# EAGLE design Solar Charger Board (EAGLE 7.2.0)
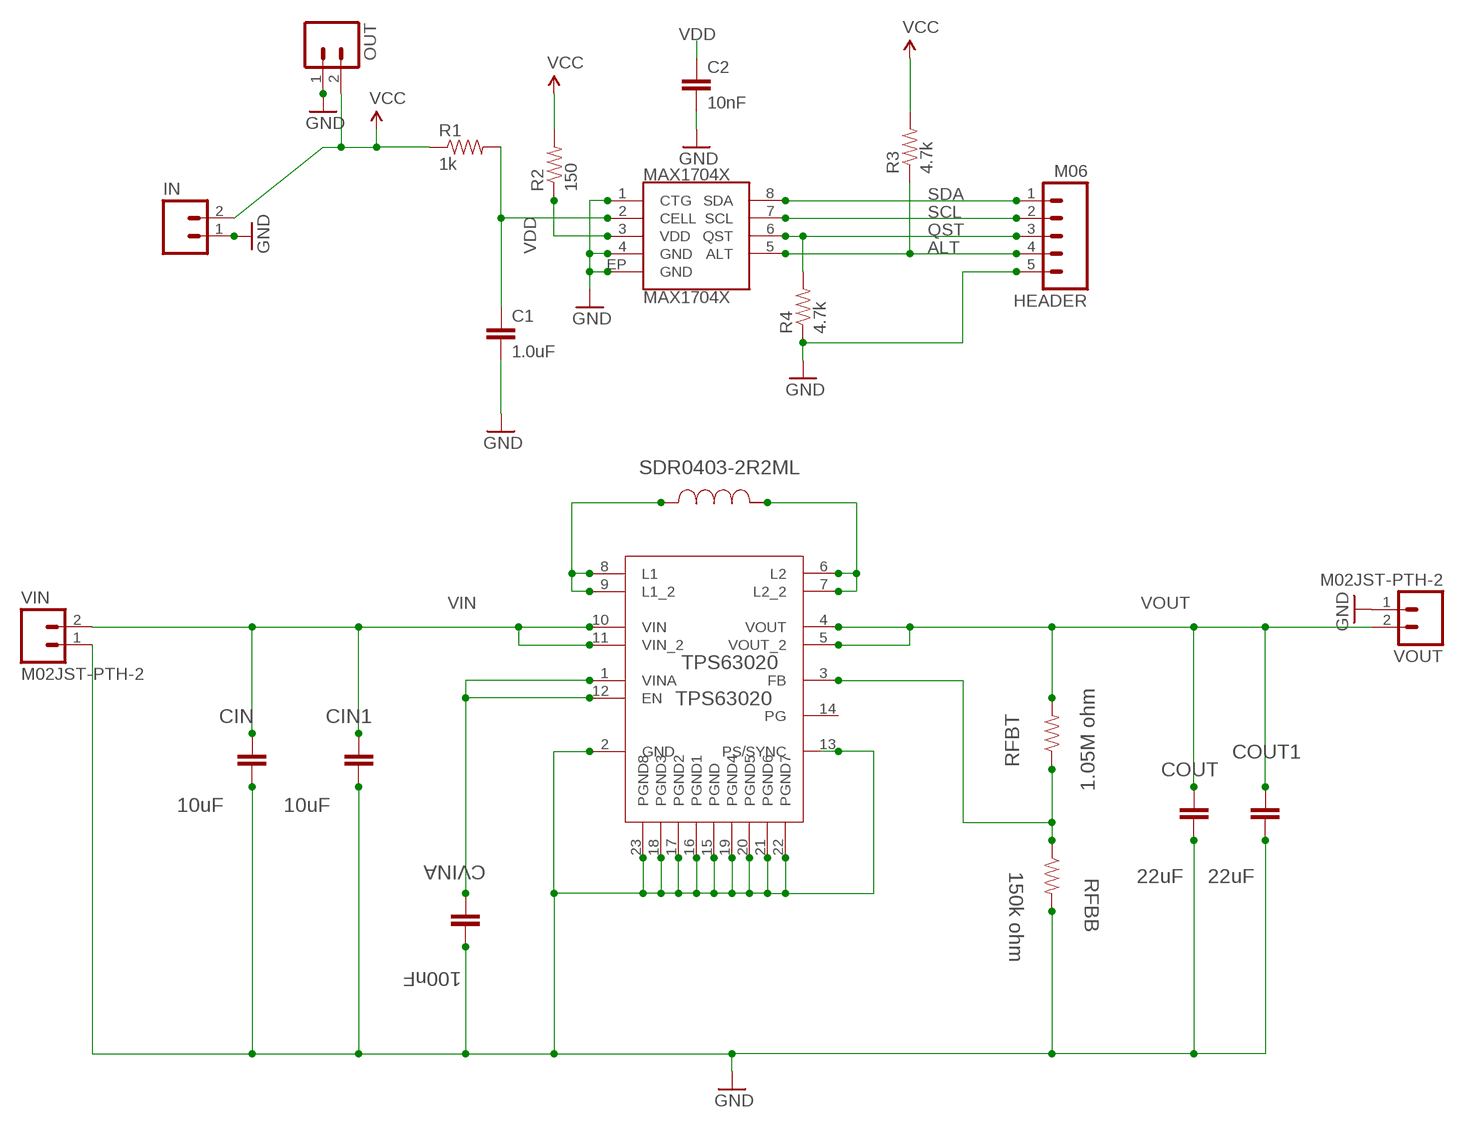
[diagram p0: schematic, sheet 1]

## Parts
C1  1.0uF  1.0UF-25V-+80/-20(0805)  [0805]
C2  10nF  2.2UF-25V-+80/-20(0805)  [0805]
CIN  10uF  CAP0805  [0805]
CIN1  10uF  CAP0805  [0805]
COUT  22uF  CAP0805  [0805]
COUT1  22uF  CAP0805  [0805]
CVINA  100nF  CAP0805  [0805]
HEADER  M06  M05PTH  [1X05]
IN  input  M02JST-PTH-2  [JST-2-PTH]
L1  SDR0403-2R2ML  [SDR0403]
MAX1704X  MAX1704X  [TDFN-8]
OUT  M02JST-PTH-2  [JST-2-PTH]
R1  1k  RESISTOR0805-RES  [0805]
R2  150  RESISTOR0805-RES  [0805]
R3  4.7k  RESISTOR0805-RES  [0805]
R4  4.7k  RESISTOR0805-RES  [0805]
RFBB  150k ohm  RESISTOR0805-RES  [0805]
RFBT  1.05M ohm  RESISTOR0805-RES  [0805]
TPS63020  TPS63020  [QFN14-3X4MM]
VIN  M02JST-PTH-2  [JST-2-PTH]
VOUT  M02JST-PTH-2  [JST-2-PTH]

## Nets
ALT: HEADER.4 MAX1704X.5(ALT) R3.1
FB: RFBB.1 RFBT.1 TPS63020.3(FB)
GND: C1.2 C2.2 CIN1.2 CIN.2 COUT1.2 COUT.2 CVINA.2 HEADER.5 IN.1 MAX1704X.1(CTG) MAX1704X.4(GND) MAX1704X.EP(GND) OUT.1 R4.1 RFBB.2 TPS63020.2(GND) TPS63020.13(PS/SYNC) TPS63020.15(PGND) TPS63020.16(PGND1) TPS63020.17(PGND2) TPS63020.18(PGND3) TPS63020.19(PGND4) TPS63020.20(PGND5) TPS63020.21(PGND6) TPS63020.22(PGND7) TPS63020.23(PGND8) VIN.1 VOUT.1
N$1: CVINA.1 TPS63020.1(VINA) TPS63020.12(EN)
N$2: C1.1 MAX1704X.2(CELL) R1.2
N$3: L1.1 TPS63020.8(L1) TPS63020.9(L1_2)
N$4: L1.2 TPS63020.6(L2) TPS63020.7(L2_2)
QST: HEADER.3 MAX1704X.6(QST) R4.2
SCL: HEADER.2 MAX1704X.7(SCL)
SDA: HEADER.1 MAX1704X.8(SDA)
VCC: IN.2 OUT.2 R1.1 R2.2 R3.2
VDD: C2.1 MAX1704X.3(VDD) R2.1
VIN: CIN1.1 CIN.1 TPS63020.10(VIN) TPS63020.11(VIN_2) VIN.2
VOUT: COUT1.1 COUT.1 RFBT.2 TPS63020.4(VOUT) TPS63020.5(VOUT_2) VOUT.2
Unconnected: TPS63020.14(PG)

## Library data of the parts
C1 = SparkFun-Capacitors:1.0UF-25V-+80/-20(0805): CAP-11625; PROD_ID: CAP-11625
C2 = SparkFun-Capacitors:2.2UF-25V-+80/-20(0805): CAP-11624; PROD_ID: CAP-11624; VALUE: 2.2uF
CIN CIN1 COUT COUT1 CVINA = SparkFun-Passives:CAP: Capacitor Standard 0603 ceramic capacitor, and 0.1" leaded capacitor.
HEADER = SparkFun-Connectors:M05: Header 5 Standard 5-pin 0.1" header. Use with straight break away headers (SKU : PRT-00116), right angle break away headers (PRT-00553), swiss pins (PRT-00743), machine pins (PRT-00117), and female headers (PRT-00115). Molex polarized connector foot print use with SKU : PRT-08230 with associated crimp pins and housings.
IN OUT VIN VOUT = SparkFun-Connectors:M02: Standard 2-pin 0.1" header. Use with - straight break away headers ( PRT-00116) - right angle break away headers (PRT-00553) - swiss pins (PRT-00743) - machine pins (PRT-00117) - female headers (PRT-00115) Molex polarized connector foot print use with: PRT-08233 with associated crimp pins and housings. 2.54_SCREWTERM for use with PRT-10571. 3.5mm Screw Terminal footprints for PRT-08084 5mm Screw Terminal footprints for use with PRT-08433; SKU: PRT-09914
L1 = TPS63020:SDR0403-2R2ML; DCR: 0.047; IDC: 2.6; L: 2.2E-6; MANUFACTURER_NAME: Bourns; MANUFACTURER_PART_NUMBER: SDR0403-2R2ML; VENDOR: Bourns
MAX1704X = SparkFun:MAX1704X: MAX17043/MAX17044: Battery Fuel Guage (43 is 1cell, 44 is 2cell)
R1-R4 RFBB RFBT = SparkFun-Passives:RESISTOR: Resistor Basic schematic elements and footprints for 0603, 1206, and PTH resistors.
TPS63020 = TI Power and Battery:TPS63020

## Board
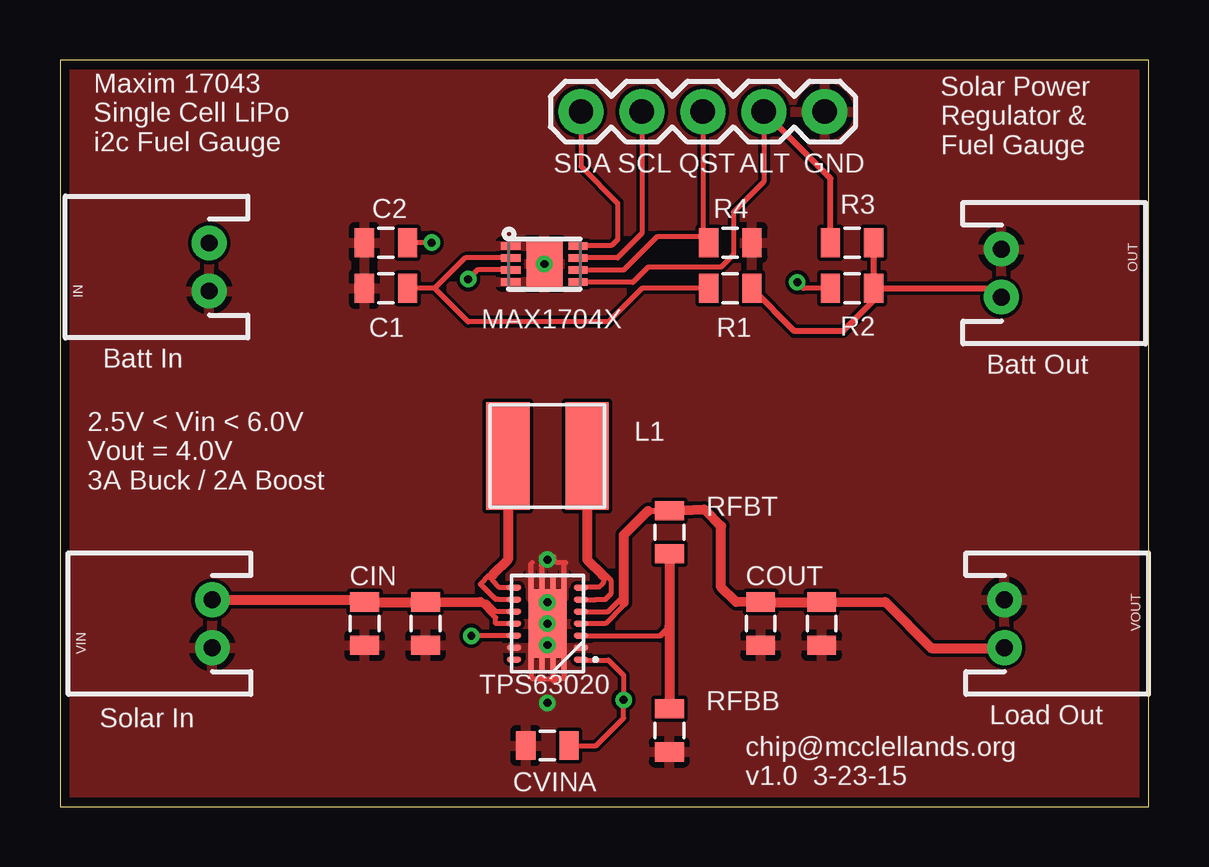
[diagram p1: board, top side]
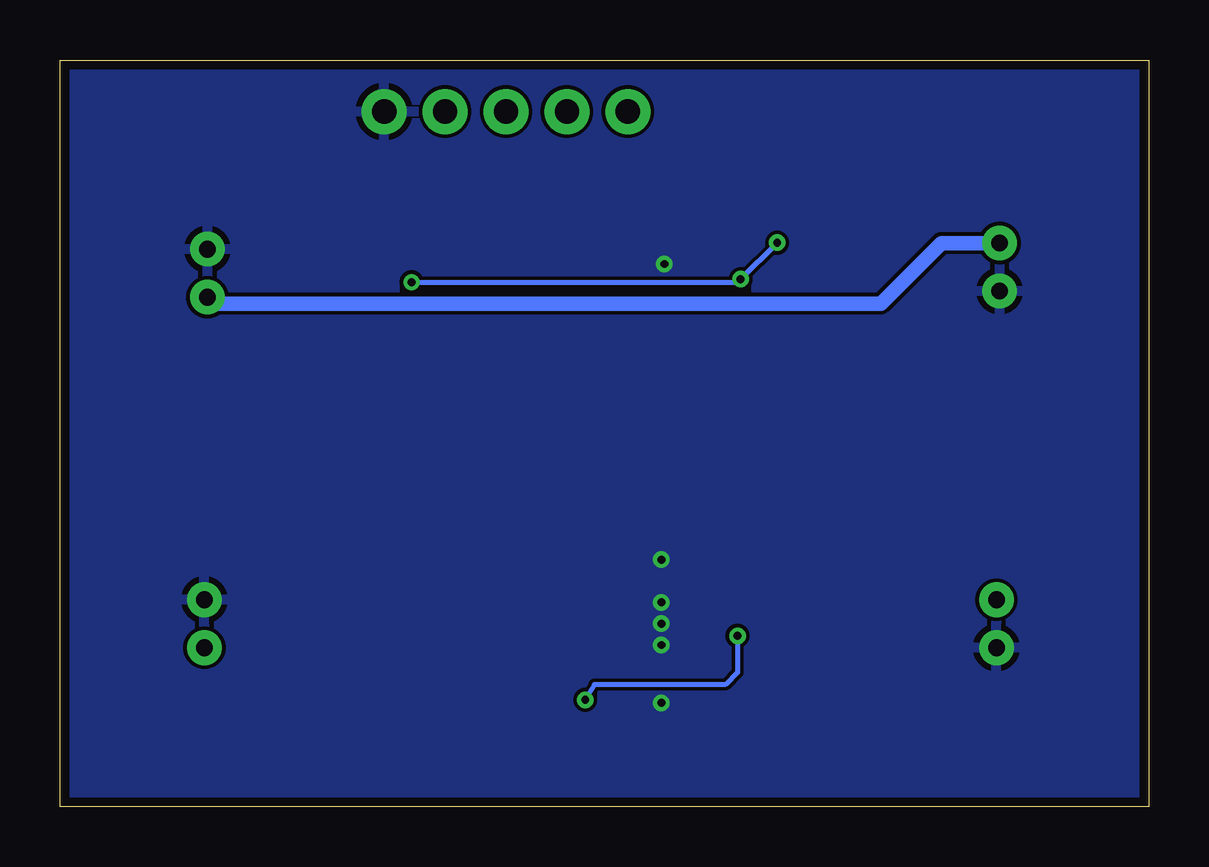
[diagram p2: board, bottom side, seen from below]

Size 45.39 x 31.11 mm. Coordinates in mm from the lower left corner, seen from the top.
Outline: 0,0 45.39,0 45.39,31.11 0,31.11 0,0
Copper layers (1*16): Top 0.0356mm / dielectric 1.5011mm / Bottom 0.0356mm
Design rules "LaenPCBOrder": minimum track width 6mil, minimum drill 13mil, track to track 6mil, track to pad 6mil, pad to pad 6mil, via to via 6mil, smd to smd 6mil, copper to edge 15mil, drill to drill 6mil, minimum pad ring 7mil, minimum via ring 7mil, stop-mask expansion 3mil, vias tented up to drill 0mil, thermal gap 10mil

### Footprints (pad centres in the part's own frame; a part is rotated, then mirrored left to right if it is on the bottom)
0805 = smd 0.8 x 1.2: 1 -0.9,0; 2 0.9,0
1X05 = drill 1.016 pad 1.88: 1 0,0; 2 2.54,0; 3 5.08,0; 4 7.62,0; 5 10.16,0
JST-2-PTH = drill 0.7 pad 1.448: 1 -1,0; 2 1,0
SDR0403 = smd 1.803 x 4.496: 1 -1.651,0; 2 1.651,0
TDFN-8 = smd 0.8 x 0.3: 1 -1.4,0.75; 2 -1.4,0.25; 3 -1.4,-0.25; 4 -1.4,-0.75; 5 1.4,-0.75; 6 1.4,-0.25; 7 1.4,0.25; 8 1.4,0.75 | smd 1.5 x 1.88: EP 0,0
QFN14-3X4MM = smd 0.6 x 0.24: 1 -1.4,1.5; 2 -1.4,1; 3 -1.4,0.5; 4 -1.4,0; 5 -1.4,-0.5; 6 -1.4,-1; 7 -1.4,-1.5; 8 1.4,-1.5; 9 1.4,-1; 10 1.4,-0.5; 11 1.4,0; 12 1.4,0.5; 13 1.4,1; 14 1.4,1.5 | smd 1.58 x 2.85: 15 0,0 | smd 0.2 x 0.575: 16 -0.69,1.712; 17 -0.23,1.712; 18 0.23,1.712; 19 0.69,1.712; 20 0.69,-1.712; 21 0.23,-1.712; 22 -0.23,-1.712; 23 -0.69,-1.712

### Placement (x,y rotation side)
C1  13.59,21.59 180 top
C2  13.59,23.5 180 top
CIN  15.24,7.62 270 top
CIN1  12.7,7.62 270 top
COUT  29.21,7.62 270 top
COUT1  31.75,7.62 270 top
CVINA  20.32,2.54 180 top
HEADER  21.72,28.96 0 top
IN  6.22,22.48 90 top
L1  20.32,14.61 0 top
MAX1704X  20.19,22.61 0 top
OUT  39.24,22.23 270 top
R1  27.94,21.59 180 top
R2  33.02,21.59 0 top
R3  33.02,23.5 0 top
R4  27.94,23.5 180 top
RFBB  25.4,3.17 270 top
RFBT  25.4,11.43 90 top
TPS63020  20.32,7.62 180 top
VIN  6.35,7.62 90 top
VOUT  39.37,7.62 270 top

### Tracks (layer width: path | path; a pad name or v marks a point on that pad's centre or on a via)
ALT
  Top 0.203: HEADER.4 29.34,26.04 28.07,24.77 28.07,22.99 27.56,22.48 24.51,22.48 23.88,21.84 21.61,21.84 MAX1704X.5
  Top 0.254: R3.1 32.12,26.17 HEADER.4
FB
  Top 0.203: TPS63020.3 25.03,7.12
  Top 0.254: 25.03,7.12 25.4,7.49
  Top 0.406: RFBT.1 25.4,7.49 RFBB.1
GND  (via drill 0.33)
  Top 0.203: TPS63020.16 21.01,5.41 21.08,5.33 20.7,5.33 20.57,5.21 20.57,5.33 | 20.57,5.33 20.57,5.88 TPS63020.17 20.55,6.37 v20.32,6.73 | TPS63020.19 19.63,5.39 19.68,5.33 20.57,5.33 | TPS63020.20 19.63,10.11 19.68,10.16 | 20.07,10.03 20.07,10.41 20.19,10.29 v20.32,10.29 20.09,10.06 TPS63020.21 | TPS63020.23 21.01,10.09 21.08,10.16 20.7,10.16 20.57,10.29 20.57,10.41
  other vias: 20.32,8.51 20.32,4.32 20.32,7.62 20.19,22.61
  pour Bottom: -3.81,34.29 49.53,34.29 49.53,-2.54 -3.81,-2.54
  pour Top: 52.07,39.37 52.07,-12.7 -7.62,-12.7 -7.62,39.37
N$1  (via drill 0.33)
  Top 0.203: TPS63020.12 17.15,7.12 v17.14,7.11 | TPS63020.1 21.74,6.1 22.86,6.1 23.5,5.46 v23.5,4.45 23.5,3.68 22.35,2.54 CVINA.1
  Bottom 0.203: v17.14,7.11 17.14,5.59 17.65,5.08 23.11,5.08 v23.5,4.45
N$2
  Top 0.203: R1.2 24.26,21.59 22.86,20.19 17.02,20.19 15.62,21.59 | 15.62,21.59 C1.1 | MAX1704X.2 16.89,22.86 15.62,21.59
N$3
  Top 0.203: TPS63020.8 18.9,9.14 18.29,9.14 18.03,9.4 18.03,9.65 17.91,9.53 17.91,9.65 17.53,9.27 18.16,8.64 18.29,8.64 18.3,8.62 TPS63020.9
  Top 0.406: L1.1 18.67,10.29 18.03,9.65
N$4
  Top 0.203: 22.61,9.65 22.73,9.65 | 22.73,9.65 22.61,9.27 22.48,9.14 21.74,9.14 TPS63020.7 | TPS63020.6 22.34,8.62 22.35,8.64 22.73,8.64 22.99,8.89 22.99,9.4 22.73,9.65
  Top 0.406: L1.2 21.97,10.29 22.61,9.65
QST
  Top 0.203: HEADER.3 26.8,23.74 | 26.8,23.74 R4.2 | 26.8,23.74 24.88,23.74 23.5,22.35 MAX1704X.6
SCL
  Top 0.203: HEADER.2 24.26,23.88 23.24,22.86 MAX1704X.7
SDA
  Top 0.203: HEADER.1 21.72,26.67 23.24,25.15 23.24,23.62 22.99,23.37 21.61,23.37 MAX1704X.8
VCC
  Top 0.254: R2.2 38.88,21.59 OUT.2 | R2.2 R3.2 | R2.2 33.92,21.09 32.64,19.81 30.62,19.81 R1.1
  Bottom 0.61: IN.2 8.65,23.48 11.18,20.95 38.97,20.95 OUT.2
VDD  (via drill 0.33)
  Top 0.203: MAX1704X.3 17.4,22.36 v17.02,21.97 | v15.49,23.5 C2.1 | R2.1 30.99,21.59 v30.73,21.84
  Bottom 0.203: v15.49,23.5 v17.02,21.97 17.14,21.84 v30.73,21.84
VIN
  Top 0.203: TPS63020.10 18.16,8.13 17.77,8.52 17.51,8.52 18.16,7.87 18.16,7.62 TPS63020.11
  Top 0.406: VIN.2 12.6,8.62 CIN1.1 CIN.1 17.51,8.52
VOUT
  Top 0.203: 23.5,8.51 23.5,8.38 22.73,7.62 TPS63020.4 | TPS63020.5 22.85,8.12 23.5,8.76
  Top 0.254: 24.51,12.32 25.34,12.32 RFBT.2
  Top 0.406: RFBT.2 26.86,12.38 27.56,11.68 27.56,9.14 28.18,8.52 COUT.1 COUT1.1 34.4,8.52 36.32,6.6 39.35,6.6 VOUT.2 | 24.51,12.32 23.5,11.3 23.5,8.76 23.5,8.51

### Text on the board
tNames: Maxim 17043 / Single Cell LiPo / i2c Fuel Gauge | Solar Power / Regulator & / Fuel Gauge | SDA | SCL | QST | ALT | GND | Batt In | Batt Out | 2.5V < Vin < 6.0V / Vout = 4.0V / 3A Buck / 2A Boost | Solar In | Load Out | chip@mcclellands.org / v1.0 3-23-15